# EAGLE design 00A-001 (EAGLE 9.6.2)
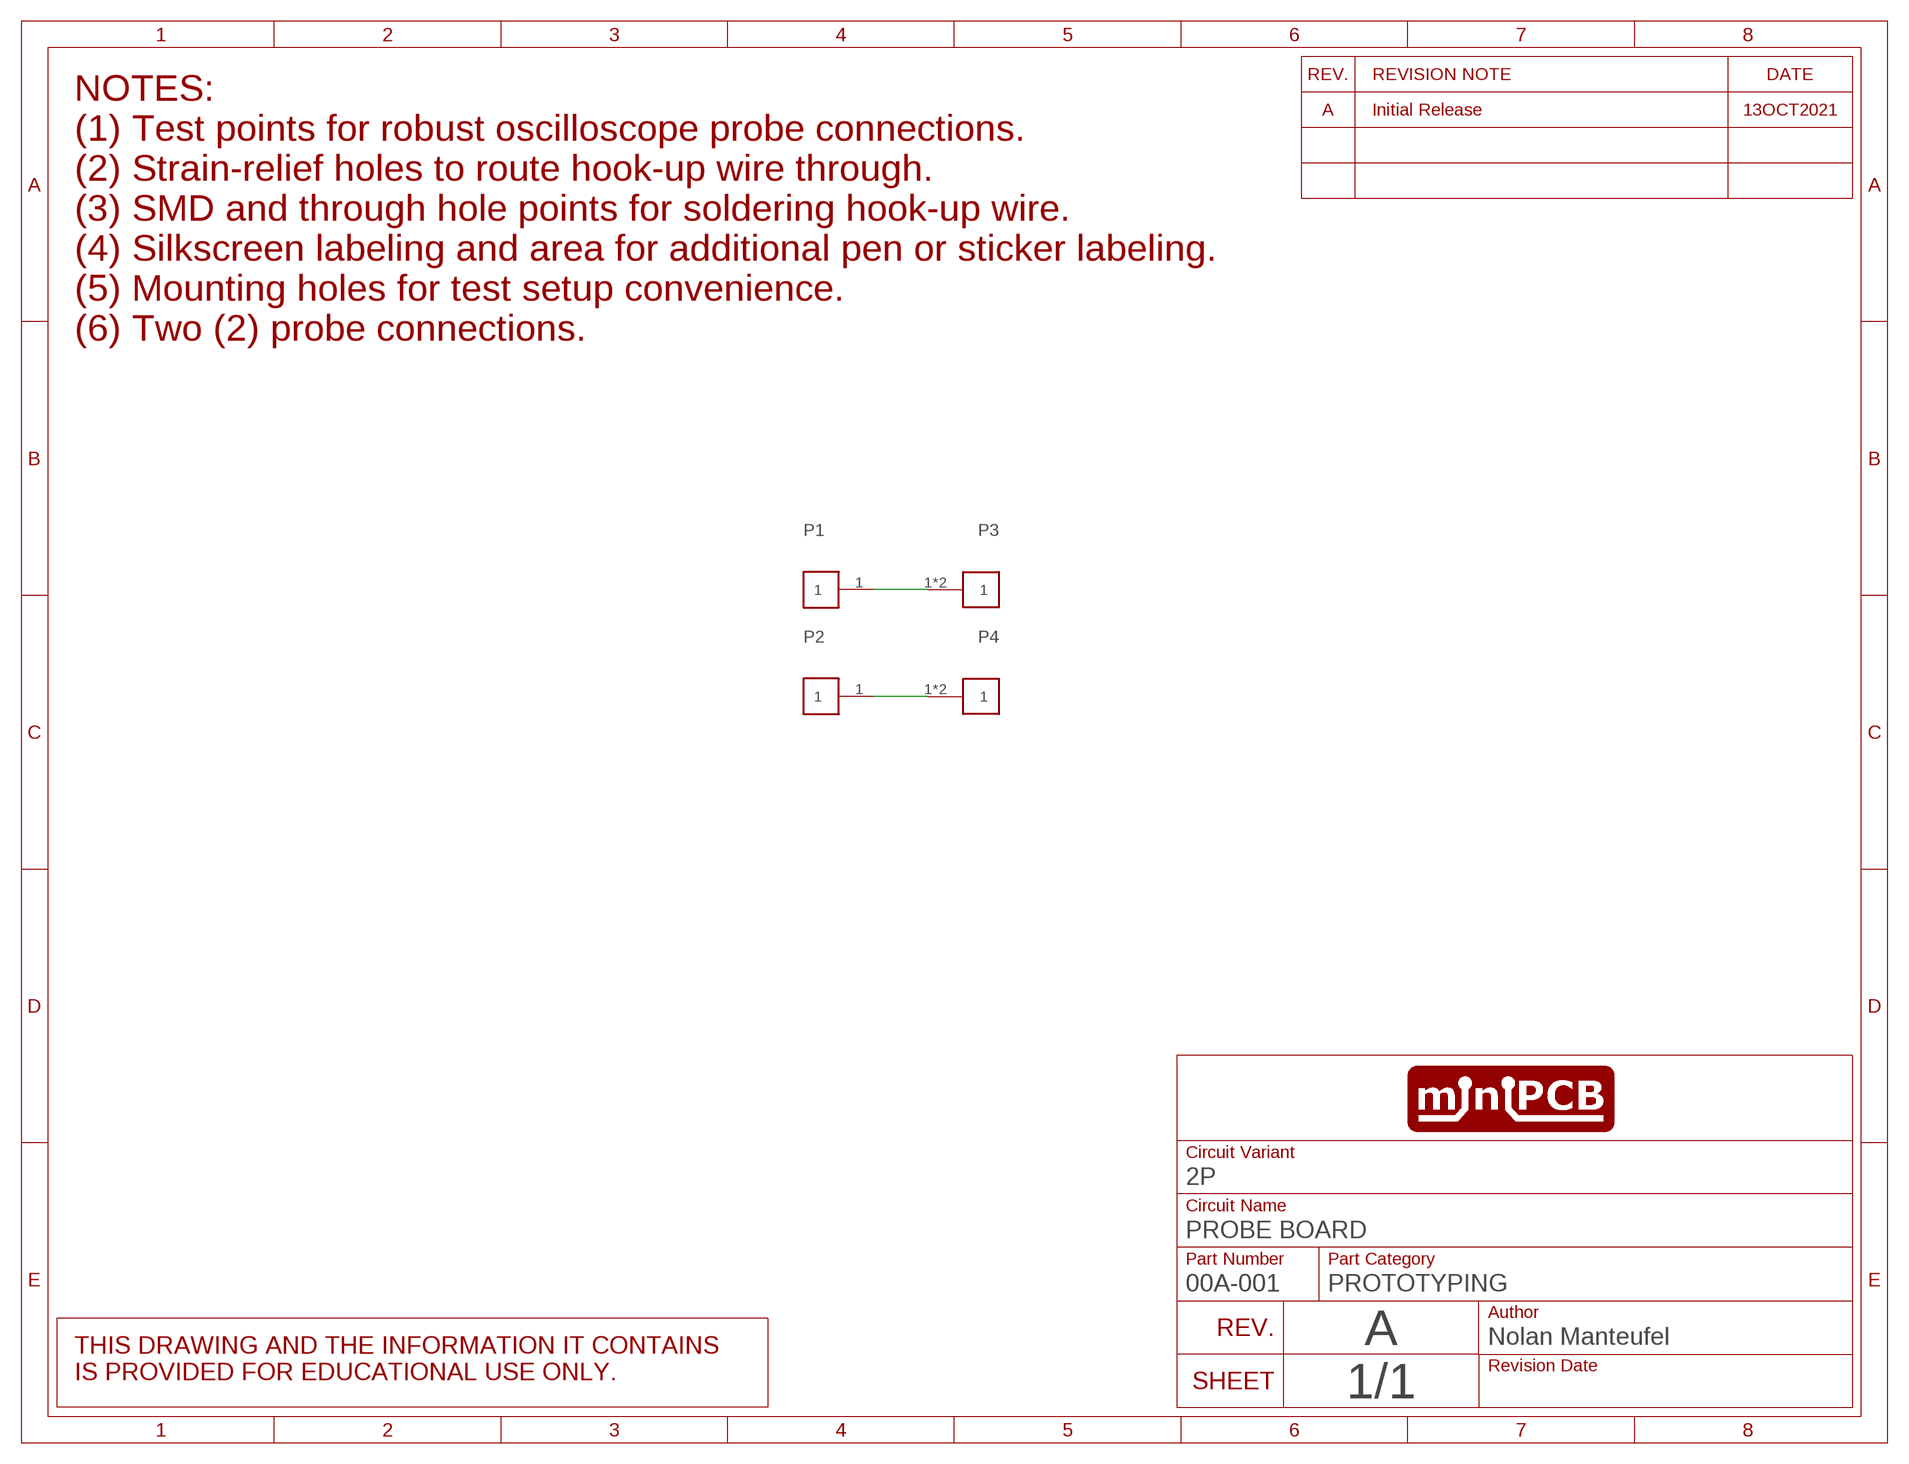
[diagram p0: schematic, sheet 1]
SHEET1 (SCHEMATIC): CIRCUIT_CATEGORY: PROTOTYPING; CIRCUIT_NAME: PROBE BOARD; REVISION: A

## Parts
P1  PINS_1KE_5000  [PINS_1_TESTPOINT_KE5000]
P2  PINS_1KE_5000  [PINS_1_TESTPOINT_KE5000]
P3  PINS_124AWG  [PINS_1_1MM]
P4  PINS_124AWG  [PINS_1_1MM]

## Nets
N$1: P1.1 P3.1 P3.2
N$2: P2.1 P4.1 P4.2

## Notes on the sheet
- NOTES:
  (1) Test points for robust oscilloscope probe connections.
  (2) Strain-relief holes to route hook-up wire through.
  (3) SMD and through hole points for soldering hook-up wire.
  (4) Silkscreen labeling and area for additional pen or sticker labeling.
  (5) Mounting holes for test setup convenience.
  (6) Two (2) probe connections.
- 13OCT2021

## Library data of the parts
P1-P4 = nolan-utsa:PINS_1

## Board
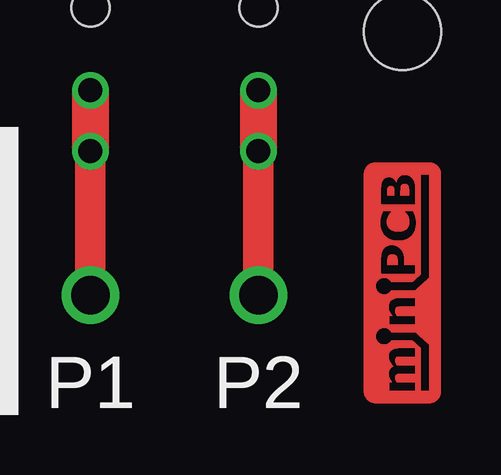
[diagram p1: board, top side]
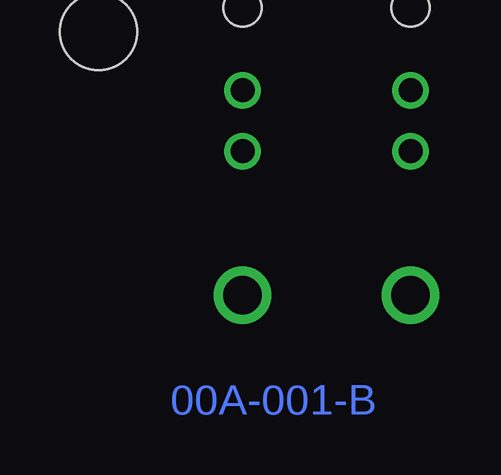
[diagram p2: board, bottom side, seen from below]

No outline drawn. Coordinates in mm, seen from the top.
Copper layers (1*16): Top 0.035mm / dielectric 1.5mm / Bottom 0.035mm
Design rules "default": minimum track width 10mil, minimum drill 24mil, track to track 8mil, track to pad 8mil, pad to pad 8mil, via to via 8mil, smd to smd 8mil, copper to edge 40mil, drill to drill 8mil, minimum pad ring 10mil, minimum via ring 8mil, stop-mask expansion 4mil, vias tented up to drill 0mil, thermal gap 10mil
Holes 1.6 mm at 9,18 16,18
Holes 3.2 mm at 3,17 22,17

### Footprints (pad centres in the part's own frame; a part is rotated, then mirrored left to right if it is on the bottom)
PINS_1_TESTPOINT_KE5000 = drill 1.6: 1 0,0
PINS_1_1MM = drill 1: 1 0,0; 2 2.54,0

### Placement (x,y rotation side)
P1  9,6 180 top
P2  16,6 180 top
P3  9,12 90 top
P4  16,12 90 top
U$1  [MINIPCB-LOGO]  22,6.5 90 top

### Tracks (layer width: path | path; a pad name or v marks a point on that pad's centre or on a via)
N$1
  Top 1.27: P3.2 P3.1 P1.1
N$2
  Top 1.27: P4.2 P4.1 P2.1

### Text on the board
Bottom: 00A-001-B
_tPlace: P1 | P2